# EAGLE design zeta2rework_lw_v2 (EAGLE 9.0.1)
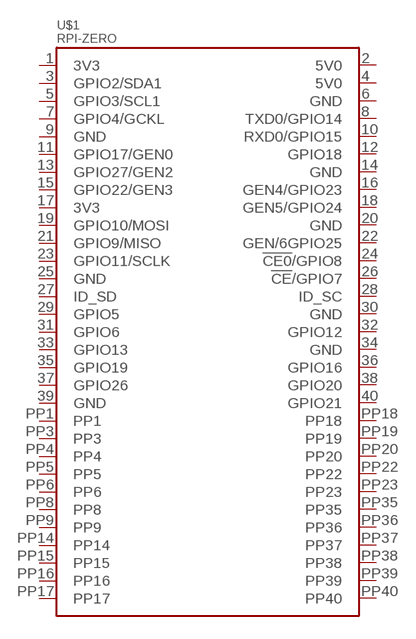
[diagram p0: schematic, sheet 1, part 1 of 2]
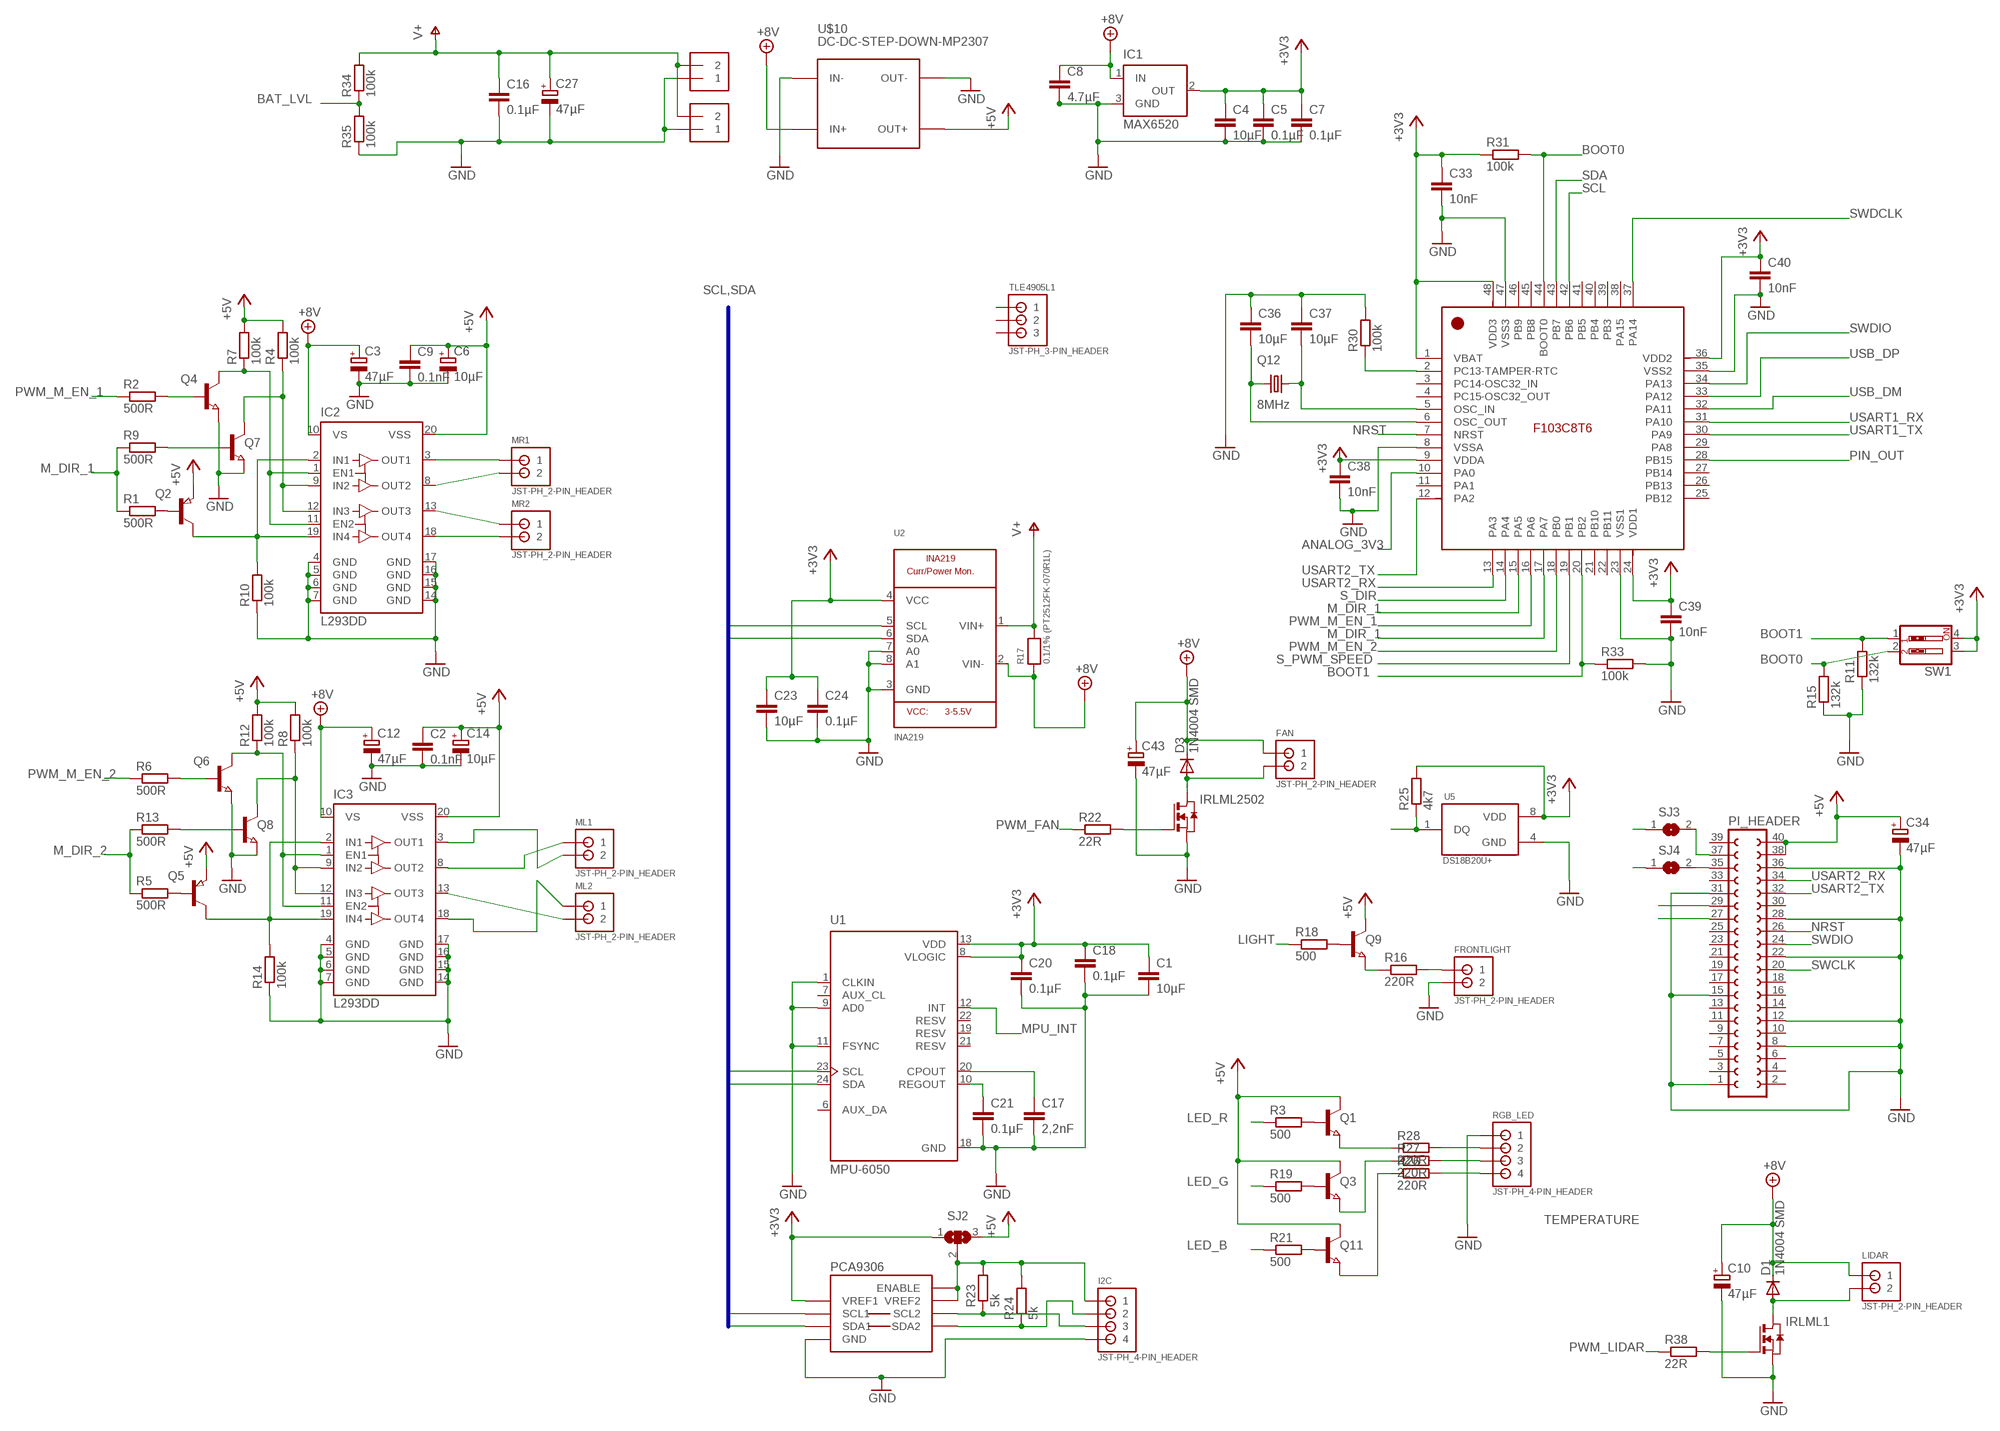
[diagram p1: schematic, sheet 1, part 2 of 2]

## Parts
C1  10µF  C-EUC1206  [C1206]
C2  0.1nF  C-EUC1206  [C1206]
C3  47µF  CPOL-EUUD-4X5,8  [UD-4X5,8_NICHICON]
C4  10µF  C-EUC1206  [C1206]
C5  0.1µF  C-EUC1206  [C1206]
C6  10µF  CPOL-EUUD-4X5,8  [UD-4X5,8_NICHICON]
C7  0.1µF  C-EUC1206  [C1206]
C8  4.7µF  C-EUC1206  [C1206]
C9  0.1nF  C-EUC1206  [C1206]
C10  47µF  CPOL-EUUD-4X5,8  [UD-4X5,8_NICHICON]
C12  47µF  CPOL-EUUD-4X5,8  [UD-4X5,8_NICHICON]
C14  10µF  CPOL-EUUD-4X5,8  [UD-4X5,8_NICHICON]
C16  0.1µF  C-EUC1206  [C1206]
C17  2,2nF  C-EUC1206  [C1206]
C18  0.1µF  C-EUC1206  [C1206]
C20  0.1µF  C-EUC1206  [C1206]
C21  0.1µF  C-EUC1206  [C1206]
C23  10µF  C-EUC1206  [C1206]
C24  0.1µF  C-EUC1206  [C1206]
C27  47µF  CPOL-EUUD-4X5,8  [UD-4X5,8_NICHICON]
C33  10nF  C-EUC1206  [C1206]
C34  47µF  CPOL-EUUD-4X5,8  [UD-4X5,8_NICHICON]
C36  10µF  C-EUC1206  [C1206]
C37  10µF  C-EUC1206  [C1206]
C38  10nF  C-EUC1206  [C1206]
C39  10nF  C-EUC1206  [C1206]
C40  10nF  C-EUC1206  [C1206]
C43  47µF  CPOL-EUUD-4X5,8  [UD-4X5,8_NICHICON]
D1  1N4004 SMD  DIODE-MELF-MLL41  [MELF-MLL41]
D3  1N4004 SMD  DIODE-MELF-MLL41  [MELF-MLL41]
FAN  JST-PH_2-PIN_HEADER  [JST_B2B-PH_HEADER]
FRONTLIGHT  JST-PH_2-PIN_HEADER  [JST_B2B-PH_HEADER]
I2C  JST-PH_4-PIN_HEADER  [JST_B4B-PH_HEADER]
IC1  MAX6520  [SOT23]
IC2  L293DD  [SO20]
IC3  L293DD  [SO20]
IRLML1  NMOSSOT23  [SOT-23]
IRLML2502  NMOSSOT23  [SOT-23]
LIDAR  JST-PH_2-PIN_HEADER  [JST_B2B-PH_HEADER]
ML1  JST-PH_2-PIN_HEADER  [JST_B2B-PH_HEADER]
ML2  JST-PH_2-PIN_HEADER  [JST_B2B-PH_HEADER]
MR1  JST-PH_2-PIN_HEADER  [JST_B2B-PH_HEADER]
MR2  JST-PH_2-PIN_HEADER  [JST_B2B-PH_HEADER]
PCA9306  IC2_LEVEL_TRANSLATER  [SOIC-8]
PI_HEADER  FE20-2  [FE20-2]
Q1  NPN-TRANSISTOR_SOT23  [SOT23]
Q2  PNP-TRANSISTOR_SOT23  [SOT23]
Q3  NPN-TRANSISTOR_SOT23  [SOT23]
Q4  NPN-TRANSISTOR_SOT23  [SOT23]
Q5  PNP-TRANSISTOR_SOT23  [SOT23]
Q6  NPN-TRANSISTOR_SOT23  [SOT23]
Q7  NPN-TRANSISTOR_SOT23  [SOT23]
Q8  NPN-TRANSISTOR_SOT23  [SOT23]
Q9  NPN-TRANSISTOR_SOT23  [SOT23]
Q11  NPN-TRANSISTOR_SOT23  [SOT23]
Q12  8MHz  KX-13  [7.0X5.0]
R1  500R  R-EU_R0603  [R0603]
R2  500R  R-EU_R0603  [R0603]
R3  500  R-EU_R1206  [R1206]
R4  100k  R-EU_R0603  [R0603]
R5  500R  R-EU_R0603  [R0603]
R6  500R  R-EU_R0603  [R0603]
R7  100k  R-EU_R0603  [R0603]
R8  100k  R-EU_R0603  [R0603]
R9  500R  R-EU_R0603  [R0603]
R10  100k  R-EU_R0603  [R0603]
R11  132k  R-EU_R0603  [R0603]
R12  100k  R-EU_R0603  [R0603]
R13  500R  R-EU_R0603  [R0603]
R14  100k  R-EU_R0603  [R0603]
R15  132k  R-EU_R0603  [R0603]
R16  220R  R-EU_R0603  [R0603]
R17  0.1/1% (PT2512FK-070R1L)  RESISTOR2512  [2512]
R18  500  R-EU_R1206  [R1206]
R19  500  R-EU_R1206  [R1206]
R21  500  R-EU_R0603  [R0603]
R22  22R  R-EU_R0603  [R0603]
R23  5k  R-EU_R0603  [R0603]
R24  5k  R-EU_R0603  [R0603]
R25  4k7  R-EU_R0603  [R0603]
R26  220R  R-EU_R0603  [R0603]
R27  220R  R-EU_R0603  [R0603]
R28  220R  R-EU_R0603  [R0603]
R30  100k  R-EU_R0603  [R0603]
R31  100k  R-EU_R0603  [R0603]
R33  100k  R-EU_R0603  [R0603]
R34  100k  R-EU_R0603  [R0603]
R35  100k  R-EU_R0603  [R0603]
R38  22R  R-EU_R0603  [R0603]
RGB_LED  JST-PH_4-PIN_HEADER  [JST_B4B-PH_HEADER]
SJ2  SJ2W  [SJ_2]
SJ3  SOLDERJUMPERREFLOW_NOPASTE  [SOLDERJUMPER_REFLOW_NOPASTE]
SJ4  SOLDERJUMPERREFLOW_NOPASTE  [SOLDERJUMPER_REFLOW_NOPASTE]
SUPPLY_IN  TERMBLOCK_1X2-3.5MM  [1X2-3.5MM]
SUPPLY_IN1  TERMBLOCK_1X2-3.5MM  [1X2-3.5MM]
SW1  SW_DIP-2  [EDG-02]
TLE4905L1  JST-PH_3-PIN_HEADER  [JST_B3B-PH_HEADER]
U1  MPU-6050  [QFN50P400X400X95-24N]
U2  INA219  [SOT23-8]
U5  DS18B20U+  [SOP65P490X95-8N]
U$1  RPI-ZERO  [RASP_PI_ZERO_BOARD_FULL]
U$4  STM32F103C8T6  [LQFP48_7X7MM_0.5MMPP]
U$10  DC-DC-STEP-DOWN-MP2307  [DC-DC-STEP-DOWN-MP2307]

## Nets
+3V3: C1.1 C4.1 C5.1 C7.1 C18.1 C20.1 C23.1 C24.1 C33.1 C38.1 C39.1 C40.1 IC1.2(OUT) PCA9306.1(VREF1) R25.2 R31.1 SJ2.1 SW1.3 SW1.4 U1.8(VLOGIC) U1.13(VDD) U2.4(VCC) U5.8(VDD) U$4.1(VBAT) U$4.9(VDDA) U$4.24(VDD1) U$4.36(VDD2) U$4.48(VDD3)
+5V: C2.1 C6.+ C9.1 C14.+ C34.+ IC2.20(VSS) IC3.20(VSS) PI_HEADER.38 PI_HEADER.40 Q1.3(C) Q2.2(E) Q3.3(C) Q5.2(E) Q9.3(C) Q11.3(C) R4.2 R7.2 R8.2 R12.2 SJ2.3 U$10.OUT+
+8V: C3.+ C8.1 C10.+ C12.+ C43.+ D1.C D3.C FAN.P1 IC1.1(IN) IC2.10(VS) IC3.10(VS) LIDAR.P1 R17.1 U2.2(VIN-) U$10.IN+
ANALOG_3V3: U$4.10(PA0)
BAT_LVL: R34.1 R35.2
BOOT0: R15.2 R31.2 SW1.2 U$4.44(BOOT0)
BOOT1: R11.2 R33.1 SW1.1 U$4.20(PB2)
BOOT2: PI_HEADER.29
BOOT3: PI_HEADER.27
GND: C1.2 C2.2 C3.- C4.2 C5.2 C6.- C7.2 C8.2 C9.2 C10.- C12.- C14.- C16.2 C17.2 C18.2 C20.2 C21.2 C23.2 C24.2 C27.- C33.2 C34.- C36.1 C37.1 C38.2 C39.2 C40.2 C43.- FRONTLIGHT.P2 I2C.P4 IC1.3(GND) IC2.4(GND) IC2.5(GND) IC2.6(GND) IC2.7(GND) IC2.14(GND) IC2.15(GND) IC2.16(GND) IC2.17(GND) IC3.4(GND) IC3.5(GND) IC3.6(GND) IC3.7(GND) IC3.14(GND) IC3.15(GND) IC3.16(GND) IC3.17(GND) IRLML1.2(S) IRLML2502.2(S) PCA9306.4(GND) PI_HEADER.1 PI_HEADER.8 PI_HEADER.12 PI_HEADER.15 PI_HEADER.22 PI_HEADER.28 PI_HEADER.31 PI_HEADER.36 Q4.2(E) Q6.2(E) Q7.2(E) Q8.2(E) R10.1 R11.1 R14.1 R15.1 R30.2 R33.2 R35.1 RGB_LED.P1 SUPPLY_IN1.1 SUPPLY_IN.1 U1.1(CLKIN) U1.9(AD0) U1.11(FSYNC) U1.18(GND) U2.3(GND) U2.7(A0) U2.8(A1) U5.4(GND) U$4.8(VSSA) U$4.23(VSS1) U$4.35(VSS2) U$4.47(VSS3) U$10.IN- U$10.OUT-
LED_B: R21.1
LED_G: R19.1
LED_R: R3.1
LIGHT: R18.1
M_DIR_1: R1.1 R9.1 U$4.15(PA5) U$4.17(PA7)
M_DIR_2: R5.1 R13.1
MPU_INT: U1.12(INT)
N$1: IC2.9(IN2) IC2.12(IN3) Q7.3(C) R4.1
N$2: IC3.18(OUT4) ML2.P1
N$3: IC3.13(OUT3) ML2.P2
N$4: IC2.18(OUT4) MR2.P2
N$5: IC2.2(IN1) IC2.19(IN4) Q2.3(C) R10.2
N$6: IC3.9(IN2) IC3.12(IN3) Q8.3(C) R8.1
N$7: IC3.2(IN1) IC3.19(IN4) Q5.3(C) R14.2
N$8: IC2.1(EN1) IC2.11(EN2) Q4.3(C) R7.1
N$9: IC3.1(EN1) IC3.11(EN2) Q6.3(C) R12.1
N$10: Q2.1(B) R1.2
N$11: Q4.1(B) R2.2
N$12: Q7.1(B) R9.2
N$13: Q5.1(B) R5.2
N$14: Q6.1(B) R6.2
N$15: Q8.1(B) R13.2
N$16: IC2.13(OUT3) MR2.P1
N$17: IC2.8(OUT2) MR1.P2
N$18: IC2.3(OUT1) MR1.P1
N$19: Q9.1(B) R18.2
N$20: Q9.2(E) R16.1
N$21: FRONTLIGHT.P1 R16.2
N$22: Q1.1(B) R3.2
N$23: Q3.1(B) R19.2
N$24: Q1.2(E) R28.1
N$25: IC3.8(OUT2) ML1.P1
N$26: IC3.3(OUT1) ML1.P2
N$28: Q3.2(E) R27.1
N$30: Q11.2(E) R26.1
N$31: R26.2 RGB_LED.P4
N$32: Q11.1(B) R21.2
N$33: R27.2 RGB_LED.P3
N$34: C17.1 U1.20(CPOUT)
N$35: R28.2 RGB_LED.P2
N$36: C21.1 U1.10(REGOUT)
N$37: IRLML2502.3(G) R22.2
N$38: IRLML1.3(G) R38.2
N$39: D1.A IRLML1.1(D) LIDAR.P2
N$41: I2C.P1 PCA9306.7(VREF2) PCA9306.8(ENABLE) R23.2 R24.2 SJ2.2
N$42: I2C.P3 PCA9306.6(SCL2) R23.1
N$43: I2C.P2 PCA9306.5(SDA2) R24.1
N$44: PI_HEADER.37 SJ3.2
N$45: PI_HEADER.35 SJ4.2
N$46: C36.2 Q12.1 U$4.6(OSC_OUT)
N$47: C37.2 Q12.3 U$4.5(OSC_IN)
N$49: R30.1 U$4.2(PC13-TAMPER-RTC)
N$55: D3.A FAN.P2 IRLML2502.1(D)
NRST: PI_HEADER.26 U$4.7(NRST)
PIN_OUT: U$4.28(PB15)
PWM_FAN: R22.1
PWM_LIDAR: R38.1
PWM_M_EN_1: R2.1 U$4.16(PA6)
PWM_M_EN_2: R6.1 U$4.18(PB0)
S_DIR: U$4.14(PA4)
S_PWM_SPEED: U$4.19(PB1)
SCL: U1.23(SCL) U2.5(SCL) U$4.42(PB6)
SCL2: PCA9306.2(SCL1)
SCL3: SJ4.1
SDA: U1.24(SDA) U2.6(SDA) U$4.43(PB7)
SDA2: PCA9306.3(SDA1)
SDA3: SJ3.1
SWCLK: PI_HEADER.20
SWDCLK: U$4.37(PA14)
SWDIO: PI_HEADER.24 U$4.34(PA13)
TEMPERATURE: R25.1 U5.1(DQ)
USART1_RX: U$4.31(PA10)
USART1_TX: U$4.30(PA9)
USART2_RX: PI_HEADER.34 U$4.13(PA3)
USART2_TX: PI_HEADER.32 U$4.12(PA2)
USB_DM: U$4.32(PA11)
USB_DP: U$4.33(PA12)
V+: C16.1 C27.+ R17.2 R34.2 SUPPLY_IN1.2 SUPPLY_IN.2 U2.1(VIN+)
Unconnected: PI_HEADER.2 PI_HEADER.3 PI_HEADER.4 PI_HEADER.5 PI_HEADER.6 PI_HEADER.7 PI_HEADER.9 PI_HEADER.10 PI_HEADER.11 PI_HEADER.13 PI_HEADER.14 PI_HEADER.16 PI_HEADER.17 PI_HEADER.18 PI_HEADER.19 PI_HEADER.21 PI_HEADER.23 PI_HEADER.25 PI_HEADER.30 PI_HEADER.33 PI_HEADER.39 TLE4905L1.P1 TLE4905L1.P2 TLE4905L1.P3 U1.6(AUX_DA) U1.7(AUX_CL) U1.19(RESV) U1.21(RESV) U1.22(RESV) U$1.1(3V3) U$1.2(5V0) U$1.3(GPIO2/SDA1) U$1.4(5V0) U$1.5(GPIO3/SCL1) U$1.6(GND) U$1.7(GPIO4/GCKL) U$1.8(TXD0/GPIO14) U$1.9(GND) U$1.10(RXD0/GPIO15) U$1.11(GPIO17/GEN0) U$1.12(GPIO18) U$1.13(GPIO27/GEN2) U$1.14(GND) U$1.15(GPIO22/GEN3) U$1.16(GEN4/GPIO23) U$1.17(3V3) U$1.18(GEN5/GPIO24) U$1.19(GPIO10/MOSI) U$1.20(GND) U$1.21(GPIO9/MISO) U$1.22(GEN/6GPIO25) U$1.23(GPIO11/SCLK) U$1.24(!CE0!/GPIO8) U$1.25(GND) U$1.26(!CE!/GPIO7) U$1.27(ID_SD) U$1.28(ID_SC) U$1.29(GPIO5) U$1.30(GND) U$1.31(GPIO6) U$1.32(GPIO12) U$1.33(GPIO13) U$1.34(GND) U$1.35(GPIO19) U$1.36(GPIO16) U$1.37(GPIO26) U$1.38(GPIO20) U$1.39(GND) U$1.40(GPIO21) U$1.PP1 U$1.PP3 U$1.PP4 U$1.PP5 U$1.PP6 U$1.PP8 U$1.PP9 U$1.PP14 U$1.PP15 U$1.PP16 U$1.PP17 U$1.PP18 U$1.PP19 U$1.PP20 U$1.PP22 U$1.PP23 U$1.PP35 U$1.PP36 U$1.PP37 U$1.PP38 U$1.PP39 U$1.PP40 U$4.3(PC14-OSC32_IN) U$4.4(PC15-OSC32_OUT) U$4.11(PA1) U$4.21(PB10) U$4.22(PB11) U$4.25(PB12) U$4.26(PB13) U$4.27(PB14) U$4.29(PA8) U$4.38(PA15) U$4.39(PB3) U$4.40(PB4) U$4.41(PB5) U$4.45(PB8) U$4.46(PB9)

## Buses
SCL,SDA

## Library data of the parts
C1 C2 C4 C5 C7-C9 C16-C18 C20 C21 C23 C24 C33 C36-C40 = rcl:C-EU: CAPACITOR, European symbol; SPICEPREFIX: C
C3 C6 C10 C12 C14 C27 C34 C43 = rcl:CPOL-EU: POLARIZED CAPACITOR, European symbol; SPICEPREFIX: C
D1 D3 = diode:DIODE-: DIODE
FAN FRONTLIGHT LIDAR ML1 ML2 MR1 MR2 = srg:JST-PH_2-PIN_HEADER: 2-pin JST PH Shrouded Header, top entry P/N B2B-PH-K-S Mating connector PHR-2 Mating cable assembly: Sparkfun PRT-09914 <http://www.sparkfun.com/products/9914>
I2C RGB_LED = srg:JST-PH_4-PIN_HEADER: 4-pin JST PH Shrouded Header, top entry P/N B4B-PH-K-S Mating connector PHR-4 Mating cable assembly: Sparkfun PRT-09916 <http://www.sparkfun.com/products/9916>
IC1 = maxim:MAX6520: 1.2V Voltage Reference 50ppm/°C, SOT23, 3-Terminal Source: Data sheet <http://datasheets.maxim-ic.com/en/ds/MAX6520.pdf>; MF: MAXIM; MPN: MAX6520EUR-T; OC_FARNELL: unknown; OC_NEWARK: 02J4586
IC2 IC3 = st-microelectronics:L293DD: PUSH-PULL FOUR CHANNEL DRIVER WITH DIODES Source: http://www.st.com/stonline/books/pdf/docs/1330.pdf; OC_FARNELL: unknown
IRLML1 IRLML2502 = zetex:NMOSSOT23: MOS FET; OC_FARNELL: unknown; OC_NEWARK: unknown
PCA9306 = srg:IC2_LEVEL_TRANSLATER: I2C Level Translator PCA9306 Data Sheet <http://www.ti.com/lit/ds/symlink/pca9306.pdf> Sparkfun breakout board schematic <http://dlnmh9ip6v2uc.cloudfront.net/datasheets/BreakoutBoards/PCA9306_Breakout.pdf>
PI_HEADER = con-lsta:FE20-2: FEMALE HEADER; OC_FARNELL: unknown; OC_NEWARK: unknown
Q1 Q3 Q4 Q6-Q9 Q11 = semicon-smd-ipc:NPN-TRANSISTOR_: NPN TRANSISTOR
Q2 Q5 = semicon-smd-ipc:PNP-TRANSISTOR_: PNP TRANSISTOR
Q12 = crystal-geyer_V1_0:KX: Quartz Crystals (MHz) SMD: KX - Serie Model Size l/w/h [mm] Frequency Range Frequency Stability Temp. Range [°C] Load Capacitance AECQ 200 availabel Datasheet KX-4 KX-5 KX-6 KX-7 KX-9A KX-9B KX-12A KX-12B KX-13 KX-20 KX-K KX-KS 1.6/1.2/0.3 2.0/1.6/0.45 2.5/2.0/0.55 3.2/2.5/0.8 5.0/3.2/1.0 5.0/3.2/1.1 6.0/3.5/1.1 6.0/3.5/1.0 7.0/5.0 /1.3 11.6/5.5/1.6 12.3/4.5/4.2 12.3/4.5/3.2 24.0 ~ 80.0 MHz 16.0 ~ 80.0 MHz 12.0 ~ 80.0 MHz 8.0 ~ 60.0 MHz 7,68 ~ 300,0 MHz 8,0 ~ 50,0 MHz 8,0 ~ 150,0 MHz 8,0 ~ 50,0 MHz 6,0 ~ 160,0 MHz 3,579 ~ 25,0 MHz 3,579 ~ 70,0 MHz 3,579 ~ 70,0 MHz ±10 … ±50ppm ±10 … ±50ppm ±10 … ±50ppm ±10 … ±50ppm ±10 … ±50ppm ±10 … ±50ppm ±10 … ±50ppm ±10 … ±50ppm ±10 … ±50ppm ±50ppm ±10 … ±50ppm ±10 … ±50ppm (*) -40°C …+85°C (*) -40°C …+125°C (*) -40°C …+125°C (*) -40°C …+125°C (*) -40°C …+105°C (*) -40°C …+105°C (*) -40°C …+125°C (*) -40°C …+105°C (*) -40°C …+105°C (*) -40°C …+105°C (*) -40°C …+85°C (*) -40°C …+85°C 8, 8…16 8, 8…16 10, 8…16 12, 7…20 16, 10…20 16, 10…20 16, 10…20 16, 12…20 16, 12…20 16, 12…20 16, 12…30 16, 12…30 - yes yes yes - - - - - - - - KX-4.pdf <http://www.geyer-electronic.de/uploads/tx_userartikelfrequenz/GEYER-KX-4.pdf> KX-5.pdf <http://www.geyer-electronic.de/uploads/tx_userartikelfrequenz/GEYER-KX-5.pdf> KX-6.pdf <http://www.geyer-electronic.de/uploads/tx_userartikelfrequenz/GEYER-KX-6.pdf> KX-7.pdf <http://www.geyer-electronic.de/uploads/tx_userartikelfrequenz/GEYER-KX-7.pdf> KX-9A.pdf <http://www.geyer-electronic.de/uploads/tx_userartikelfrequenz/GEYER-KX-9A.pdf> KX-9B.pdf <http://www.geyer-electronic.de/uploads/tx_userartikelfrequenz/GEYER-KX-9B.pdf> KX-12A.pdf <http://www.geyer-electronic.de/uploads/tx_userartikelfrequenz/GEYER-KX-12A.pdf> KX-12B.pdf <http://www.geyer-electronic.de/uploads/tx_userartikelfrequenz/GEYER-KX-12B.pdf> KX-13.pdf <http://www.geyer-electronic.de/uploads/tx_userartikelfrequenz/GEYER-KX-13.pdf> KX-20.pdf <http://www.geyer-electronic.de/uploads/tx_userartikelfrequenz/GEYER-KX-20.pdf> KX-K.pdf <http://www.geyer-electronic.de/uploads/tx_userartikelfrequenz/GEYER-KX-K.pdf> KX-KS.pdf <http://www.geyer-electronic.de/uploads/tx_userartikelfrequenz/GEYER-KX-KS.pdf> <http://www.geyer-electronic.de/fileadmin/template/img/logo-geyer-electronic.png> Details see: http://www.geyer-electronic.de/Frequenz-Produkte.9.0.html Created 2016-06-07, Hans Locher 2016 (C) Geyer Quartz Technology KX4,KX5,KX6,KX7,KX9A,KX9B,KX12A,KX12B,KX13,KX20,KXK,KXKS;1612;2016;2520;3225;5032;6035;7050;11655;12345;1,6x1,2;2,0x1,6;2,5x2,0;3,2x2,5;5,0x3,2;6,0x3,5;7,0x5,0;11,6x5,5;12,3x4,5;12,3x4,5;1.6x1.2;2.0x1.6;2.5x2.0;3.2x2.5;5.0x3.2;6.0x3.5;7.0x5.0;11.6x5.5;12.3x4.5;12.3x4.5;
R1-R16 R18 R19 R21-R28 R30 R31 R33-R35 R38 = rcl:R-EU_: RESISTOR, European symbol; SPICEPREFIX: R
R17 = microbuilder:RESISTOR: Resistors 0402 - 0402 Surface Mount Package 22 Ohm 1% 1/16W [Digikey: 311-22.0LRTR-ND] 33 Ohm 5% 1/16W 1.0K 5% 1/16W 1.5K 5% 1/16W 2.0K 1% 1/16W 10.0K 1% 1/16W [Digikey: 311-10.0KLRTR-ND] 10.0K 5% 1/16W [Digikey: RMCF0402JT10K0TR-ND] 12.1K 1% 1/16W [Digikey: 311-22.0LRTR-ND] 100.0K 5% 1/16W 0603 - 0603 Surface Mount Package 0 Ohm 1/10 Watt 1% Resistor 15 Ohm 1/10 Watt 1% Resistor 33 Ohm 1/10 Watt 1% Resistor 49.9 Ohm 1/10 Watt 1% Resistor 100 Ohm 1/10 Watt 1% Resistor 150 Ohm 1/10 Watt 1% Resistor 240 Ohm 1/10 Watt 1% Resistor 390 Ohm 1/10 Watt 1% Resistor 560 Ohm 1/10 Watt 1% Resistor 680 Ohm 1/10 Watt 1% Resistor 750 Ohm 1/10 Watt 1% Resistor 1.0K Ohm 1/10 Watt 1% Resistor 1.5K Ohm 1/10 Watt 1% Resistor 2.0K Ohm 1/10 Watt 1% Resistor 2.2K Ohm 1/10 Watt 1% Resistor 3.3K Ohm 1/10 Watt 1% Resistor 4.7K Ohm 1/10 Watt 1% Resistor 10.0K Ohm 1/10 Watt 1% Resistor 12.0K Ohm 1/10 Watt 1% Resistor 12.1K Ohm 1/10 Watt 1% Resistor 20.0K Ohm 1/10 Watt 1% Resistor 33.0K Ohm 1/10 Watt 1% Resistor 100.0K Ohm 1/10 Watt 1% Resistor 0805 - 0805 Surface Mount Package 0 Ohm 1/8 Watt 1% Resistor 33 Ohm 1/8 Watt 1% Resistor 100 Ohm 1/8 Watt 1% Resistor 150 Ohm 1/8 Watt 1% Resistor 200 Ohm 1/8 Watt 1% Resistor 240 Ohm 1/8 Watt 1% Resistor 330 Ohm 1/8 Watt 1% Resistor 390 Ohm 1/8 Watt 1% Resistor 470 Ohm 1/8 Watt 1% Resistor 1.0K Ohm 1/8 Watt 1% Resistor 1.5K Ohm 1/8 Watt 1% Resistor 2.0K Ohm 1/8 Watt 1% Resistor 4.7K Ohm 1/8 Watt 1% Resistor 5.1K Ohm 1/8 Watt 1% Resistor 5.6K Ohm 1/8 Watt 1% Resistor 10.0K Ohm 1/8 Watt 1% Resistor 22.0K Ohm 1/8 Watt 1% Resistor 33.0K Ohm 1/8 Watt 1% Resistor 100K Ohm 1/8 Watt 1% Resistor 1206 - 1206 Surface Mount Package 2012 - 2010 Surface Mount Package 0.11 Ohm 1/2 Watt 1% Resistor - Digikey: RHM.11UCT-ND
SJ2 = jumper:SJ2W: SMD solder JUMPER
SJ3 SJ4 = microbuilder:SOLDERJUMPER: SMD Solder JUMPER Solder the two pads together to create a connection, or remove the solder to break it. REFLOW - Use this footprint for solder paste and reflow ovens. WAVE - Use this footprint for hand-soldering (larger pads). CLOSED - Has a trace between the two pads to ensure it is closed by default. The trace needs to be cut to disable the jumper, and can be closed again by creating a solder bridge between the two pads.
SUPPLY_IN SUPPLY_IN1 = microbuilder:TERMBLOCK_1X2: 3.5mm Terminal block http://www.ladyada.net/library/pcb/eaglelibrary.html
SW1 = special:SW_DIP-2: DIP SWITCH
TLE4905L1 = srg:JST-PH_3-PIN_HEADER: 3-pin JST PH Shrouded Header, top entry P/N B3B-PH-K-S Mating connector PHR-3
U1 = MPU-6050:MPU-6050: MPU-6050 Six-Axis (Gyro + Accelerometer) MEMS MotionTracking™ Devices; AVAILABILITY: Good; DESCRIPTION: 3-axis gyroscope, 3-axis accelerometer in a 4x4x0.9 housing; MF: TDK; MP: MPU-6050; PACKAGE: QFN-24 InvenSense; PRICE: 5.12 USD
U2 = INA219:INA219: INA219 - I2C Current/Power Monitor Voltage Range: 0-26V Accuracy: 0.5% Temperature: -40°C - 125°C; AVAILABILITY: Unavailable; DESCRIPTION: the ina219 is a high-side current shunt and power monitor with an i2c interface. the ina219 monitors both shunt drop ...; MF: Texas Instruments; MP: INA219; PACKAGE: None; PRICE: None
U5 = DS18B20U_:DS18B20U+: Board Mount Temperature Sensors Prgmble Resolution 1-Wire Parasite Pwr; AVAILABILITY: Unavailable; DESCRIPTION: Date Code: 1043+; RoHS Compliant: Yes;; MF: Maxim; MP: DS18B20U+; PACKAGE: TSSOP-8 Chip Coolers; PRICE: None
U$1 = rpi-zero:RPI-ZERO
U$4 = STM32F103C8T6:STM32F103C8T6; AVAILABILITY: Good; DESCRIPTION: Mainstream Performance line, ARM Cortex-M3 MCU with 64 Kbytes Flash, 72 MHz CPU, motor control, USB and CAN; MF: STMicroelectronics; MP: STM32F103C8T6; PACKAGE: LQFP-48 STMicroelectronics; PRICE: 3.83 USD
U$10 = diy-modules:DC-DC-STEP-DOWN-MP2307: DC/DC Step-Down Regulator based on MP2307DN chip MP2307 datasheet available here: https://cdn-shop.adafruit.com/datasheets/MP2307_r1.9.pdf Click here to find device on ebay.com <http://www.ebay.com/sch/dc+dc+3a+mini+converter>

## Board
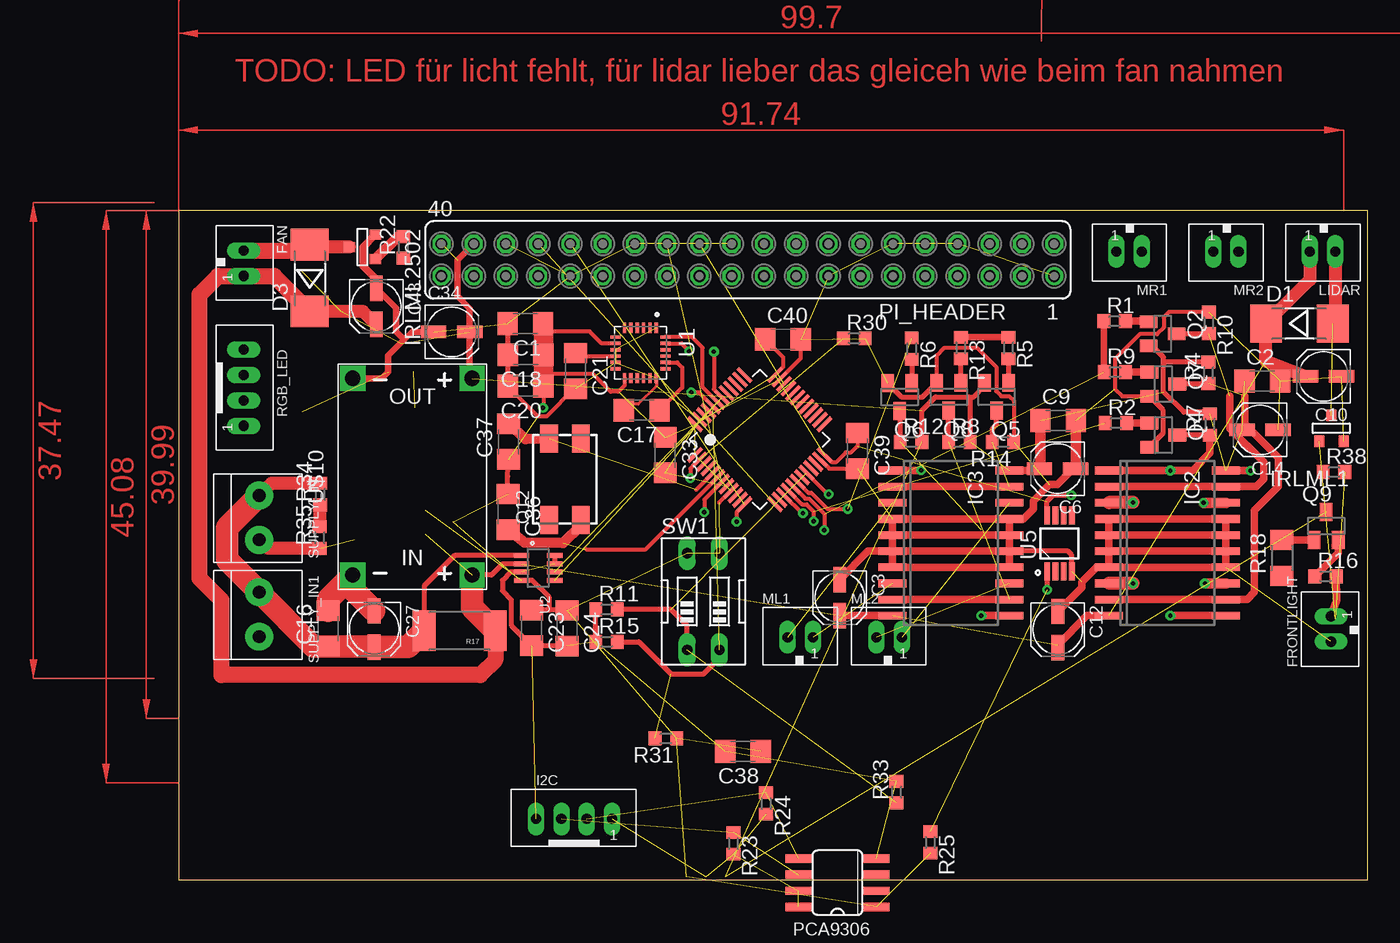
[diagram p2: board, top side]
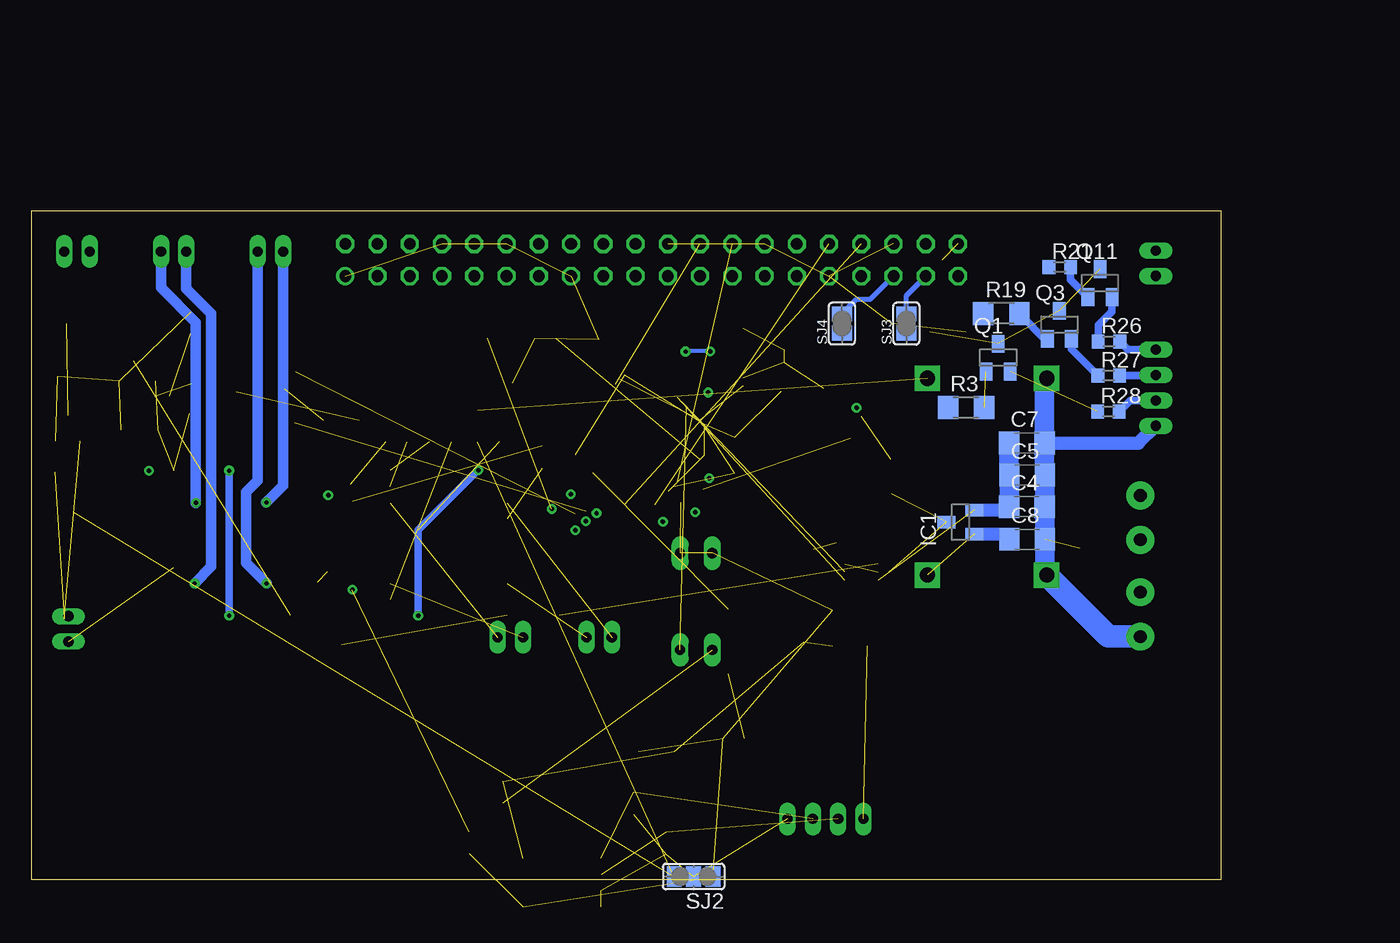
[diagram p3: board, bottom side, seen from below]

Size 93.65 x 52.7 mm. Coordinates in mm from the lower left corner, seen from the top.
Outline: 0,0 93.65,0 93.65,52.7 0,52.7 0,0
Copper layers (1*16): Top 0.035mm / dielectric 1.5mm / Bottom 0.035mm
Design rules "default": minimum track width 6mil, minimum drill 0.35mm, track to track 6mil, track to pad 6mil, pad to pad 6mil, via to via 6mil, smd to smd 6mil, copper to edge 40mil, drill to drill 6mil, minimum pad ring 10mil, minimum via ring 8mil, stop-mask expansion 4mil, vias tented up to drill 0mil, thermal gap 10mil

### Footprints (pad centres in the part's own frame; a part is rotated, then mirrored left to right if it is on the bottom)
C1206 = smd 1.6 x 1.8: 1 -1.4,0; 2 1.4,0
UD-4X5,8_NICHICON = smd 2 x 1: + 1.425,0; - -1.425,0
MELF-MLL41 = smd 2.5 x 3: A 2.625,0; C -2.625,0
JST_B2B-PH_HEADER = drill 0.8 long: P1 1.075,0.048; P2 -0.925,0.048
JST_B4B-PH_HEADER = drill 0.8 long: P1 2.98,0.048; P2 0.98,0.048; P3 -1.02,0.048; P4 -3.02,0.048
SOT23 = smd 1 x 1.4: 1 -0.95,-1.1; 2 0.95,-1.1; 3 0,1.1
SO20 = smd 0.6 x 2.2: 1 -5.715,-4.6; 2 -4.445,-4.6; 3 -3.175,-4.6; 4 -1.905,-4.6; 5 -0.635,-4.6; 6 0.635,-4.6; 7 1.905,-4.6; 8 3.175,-4.6; 9 4.445,-4.6; 10 5.715,-4.6; 11 5.715,4.6; 12 4.445,4.6; 13 3.175,4.6; 14 1.905,4.6; 15 0.635,4.6; 16 -0.635,4.6; 17 -1.905,4.6; 18 -3.175,4.6; 19 -4.445,4.6; 20 -5.715,4.6
SOT-23 = smd 0.787 x 0.889: 1 0.025,-1.016; 2 -0.94,1.016; 3 0.991,1.016
SOIC-8 = smd 0.66 x 2.032: 1 -1.905,-3.073; 2 -0.635,-3.073; 3 0.635,-3.073; 4 1.905,-3.073; 5 1.905,3.073; 6 0.635,3.073; 7 -0.635,3.073; 8 -1.905,3.073
FE20-2 = drill 0.914: 1 -24.13,1.27 | drill 0.914 octagon: 2 -24.13,-1.27; 3 -21.59,1.27; 4 -21.59,-1.27; 5 -19.05,1.27; 6 -19.05,-1.27; 7 -16.51,1.27; 8 -16.51,-1.27; 9 -13.97,1.27; 10 -13.97,-1.27; 11 -11.43,1.27; 12 -11.43,-1.27; 13 -8.89,1.27; 14 -8.89,-1.27; 15 -6.35,1.27; 16 -6.35,-1.27; 17 -3.81,1.27; 18 -3.81,-1.27; 19 -1.27,1.27; 20 -1.27,-1.27; 21 1.27,1.27; 22 1.27,-1.27; 23 3.81,1.27; 24 3.81,-1.27; 25 6.35,1.27; 26 6.35,-1.27; 27 8.89,1.27; 28 8.89,-1.27; 29 11.43,1.27; 30 11.43,-1.27; 31 13.97,1.27; 32 13.97,-1.27; 33 16.51,1.27; 34 16.51,-1.27; 35 19.05,1.27; 36 19.05,-1.27; 37 21.59,1.27; 38 21.59,-1.27; 39 24.13,1.27; 40 24.13,-1.27
7.0X5.0 = smd 2.2 x 1.4: 1 -3.2,-1.25; 2 3.2,-1.25; 3 3.2,1.25; 4 -3.2,1.25
R0603 = smd 1 x 1.1: 1 -0.85,0; 2 0.85,0
R1206 = smd 1.6 x 1.803: 1 -1.422,0; 2 1.422,0
2512 = smd 1.8 x 3.2: 1 -2.8,0; 2 2.8,0
SJ_2 = smd 1.168 x 1.6: 1 -1.524,0; 2 0,0; 3 1.524,0
SOLDERJUMPER_REFLOW_NOPASTE = smd 1.168 x 1.6: 1 -0.762,0; 2 0.762,0
1X2-3.5MM = drill 1 pad 2.184: 1 1.8,0; 2 -1.7,0
EDG-02 = drill 0.813 long: 1 -1.27,-3.81; 2 1.27,-3.81; 3 1.27,3.81; 4 -1.27,3.81
JST_B3B-PH_HEADER = drill 0.8 long: P1 2.027,0.048; P2 0.028,0.048; P3 -1.972,0.048
QFN50P400X400X95-24N = smd 0.79 x 0.26: 1 -1.97,1.25; 2 -1.97,0.75; 3 -1.97,0.25; 4 -1.97,-0.25; 5 -1.97,-0.75; 6 -1.97,-1.25; 13 1.97,-1.25; 14 1.97,-0.75; 15 1.97,-0.25; 16 1.97,0.25; 17 1.97,0.75; 18 1.97,1.25 | smd 0.26 x 0.79: 7 -1.25,-1.97; 8 -0.75,-1.97; 9 -0.25,-1.97; 10 0.25,-1.97; 11 0.75,-1.97; 12 1.25,-1.97; 19 1.25,1.97; 20 0.75,1.97; 21 0.25,1.97; 22 -0.25,1.97; 23 -0.75,1.97; 24 -1.25,1.97
SOT23-8 = smd 0.4 x 1.2: 1 -0.975,-1.3; 2 -0.325,-1.3; 3 0.325,-1.3; 4 0.975,-1.3; 5 0.975,1.3; 6 0.325,1.3; 7 -0.325,1.3; 8 -0.975,1.3
SOP65P490X95-8N = smd 1.4 x 0.45: 1 -2.2,0.975; 2 -2.2,0.325; 3 -2.2,-0.325; 4 -2.2,-0.975; 5 2.2,-0.975; 6 2.2,-0.325; 7 2.2,0.325; 8 2.2,0.975
RASP_PI_ZERO_BOARD_FULL = drill 1 pad 1.778 square: 1 8.37,25.23 | drill 1 pad 1.778: 2 8.37,27.77; 3 10.91,25.23; 4 10.91,27.77; 5 13.45,25.23; 6 13.45,27.77; 7 15.99,25.23; 8 15.99,27.77; 9 18.53,25.23; 10 18.53,27.77; 11 21.07,25.23; 12 21.07,27.77; 13 23.61,25.23; 14 23.61,27.77; 15 26.15,25.23; 16 26.15,27.77; 17 28.69,25.23; 18 28.69,27.77; 19 31.23,25.23; 20 31.23,27.77; 21 33.77,25.23; 22 33.77,27.77; 23 36.31,25.23; 24 36.31,27.77; 25 38.85,25.23; 26 38.85,27.77; 27 41.39,25.23; 28 41.39,27.77; 29 43.93,25.23; 30 43.93,27.77; 31 46.47,25.23; 32 46.47,27.77; 33 49.01,25.23; 34 49.01,27.77; 35 51.55,25.23; 36 51.55,27.77; 37 54.09,25.23; 38 54.09,27.77; 39 56.63,25.23; 40 56.63,27.77 | drill 0.8 pad 1.778: PP1 10.699,4.832; PP3 7.593,8.858; PP4 7.133,14.38; PP5 55.796,23.124; PP6 10.699,2.301; PP8 5.177,8.858; PP9 9.549,14.38; PP14 58.327,18.407; PP15 55.796,14.265; PP16 55.796,20.363; PP17 58.212,21.743; PP18 55.796,17.027; PP19 58.327,15.186; PP20 56.832,9.434; PP35 17.257,2.416; PP36 60.628,12.425; PP37 56.026,2.071; PP38 53.726,2.416; PP39 58.097,12.54; PP40 18.867,6.212 | drill 0.8 pad 1.422: PP22 23.009,2.071; PP23 24.734,2.071 | hole 2.75: 3.5,3.5; 3.5,26.5; 61.5,3.5; 61.5,26.5
LQFP48_7X7MM_0.5MMPP = smd 1.5 x 0.3: 1 -4.45,2.75; 2 -4.45,2.25; 3 -4.45,1.75; 4 -4.45,1.25; 5 -4.45,0.75; 6 -4.45,0.25; 7 -4.45,-0.25; 8 -4.45,-0.75; 9 -4.45,-1.25; 10 -4.45,-1.75; 11 -4.45,-2.25; 12 -4.45,-2.75; 25 4.45,-2.75; 26 4.45,-2.25; 27 4.45,-1.75; 28 4.45,-1.25; 29 4.45,-0.75; 30 4.45,-0.25; 31 4.45,0.25; 32 4.45,0.75; 33 4.45,1.25; 34 4.45,1.75; 35 4.45,2.25; 36 4.45,2.75 | smd 0.3 x 1.5: 13 -2.75,-4.45; 14 -2.25,-4.45; 15 -1.75,-4.45; 16 -1.25,-4.45; 17 -0.75,-4.45; 18 -0.25,-4.45; 19 0.25,-4.45; 20 0.75,-4.45; 21 1.25,-4.45; 22 1.75,-4.45; 23 2.25,-4.45; 24 2.75,-4.45; 37 2.75,4.45; 38 2.25,4.45; 39 1.75,4.45; 40 1.25,4.45; 41 0.75,4.45; 42 0.25,4.45; 43 -0.25,4.45; 44 -0.75,4.45; 45 -1.25,4.45; 46 -1.75,4.45; 47 -2.25,4.45; 48 -2.75,4.45
DC-DC-STEP-DOWN-MP2307 = drill 1.2 pad 2 square: IN+ -7.747,-4.699; IN- -7.747,4.699; OUT+ 7.747,-4.699; OUT- 7.747,4.699

### Placement (x,y rotation side)
C1  27.3,43.82 180 top
C2  85.34,39.29 0 top
C3  52.07,22.23 270 top
C4  15.29,29.39 0 bottom
C5  15.27,31.88 0 bottom
C6  69.21,32.38 180 top
C7  15.29,34.39 0 bottom
C8  15.27,26.82 0 bottom
C9  69.27,36.17 0 top
C10  90.17,39.65 180 top
C12  69.24,19.71 270 top
C14  85.17,35.43 180 top
C16  11.79,19.79 90 top
C17  36.47,36.98 180 top
C18  27.33,41.35 180 top
C20  27.33,38.89 180 top
C21  31.27,40.08 270 top
C23  27.81,19.84 270 top
C24  30.61,19.81 270 top
C27  15.41,19.75 270 top
C33  38.33,33.45 270 top
C34  21.51,43.15 0 top
C36  25.96,28.98 270 top
C37  25.98,34.52 90 top
C38  44.45,10.11 180 top
C39  53.47,33.78 270 top
C40  47.6,42.57 359.8 top
C43  15.57,45.16 270 top
D1  88.27,43.82 0 top
D3  10.34,47.4 90 top
FAN  5.08,48.64 270 top
FRONTLIGHT  90.8,19.69 90 top
I2C  31.17,4.75 0 top
IC1  20.52,28.17 90 bottom
IC2  77.88,26.52 270 top
IC3  60.83,26.52 270 top
IRLML1  90.8,35.56 180 top
IRLML2502  14.48,49.86 270 top
LIDAR  90.17,49.53 180 top
ML1  48.9,19.05 0 top
ML2  55.88,19.05 0 top
MR1  74.93,49.53 180 top
MR2  82.55,49.53 180 top
PCA9306  51.89,-0.23 90 top
PI_HEADER  44.83,48.82 180 top
Q1  17.55,41.12 0 bottom
Q2  77.5,43 270 top
Q3  12.73,43.71 0 bottom
Q4  77.55,35.03 270 top
Q5  64.41,38.05 180 top
Q6  56.79,38.02 180 top
Q7  77.55,39.04 270 top
Q8  60.66,38.05 180 top
Q9  90.37,27.86 0 top
Q11  9.53,46.99 0 bottom
Q12  30.43,31.55 90 top
R1  73.71,43.99 0 top
R2  73.81,35.97 0 top
R3  20.07,37.19 0 bottom
R4  81.1,39.93 90 top
R5  65.35,41.88 270 top
R6  57.73,41.83 270 top
R7  81.23,35.86 90 top
R8  61.49,34.47 0 top
R9  73.74,39.98 0 top
R10  81.13,43.87 270 top
R11  33.71,21.29 0 top
R12  57.68,34.47 0 top
R13  61.6,41.88 270 top
R14  64.92,34.47 180 top
R15  33.71,18.75 0 top
R16  90.32,23.9 0 top
R17  22.15,19.61 180 top
R18  86.89,25.35 90 top
R19  17.3,44.6 0 bottom
R21  12.7,48.26 0 bottom
R22  17.7,49.81 90 top
R23  43.69,2.87 270 top
R24  46.28,6.02 270 top
R25  59.21,2.95 270 top
R26  8.81,42.39 0 bottom
R27  8.84,39.7 0 bottom
R28  8.86,36.88 0 bottom
R30  53.21,42.65 0 top
R31  38.38,11.13 180 top
R33  56.54,6.91 90 top
R34  11.15,30.38 90 top
R35  11.13,26.95 90 top
R38  90.98,32.11 0 top
RGB_LED  5.08,38.73 270 top
SJ2  41.53,0.25 180 bottom
SJ3  24.77,43.82 90 bottom
SJ4  29.84,43.82 90 bottom
SUPPLY_IN  6.35,28.58 270 top
SUPPLY_IN1  6.35,20.95 270 top
SW1  41.33,21.92 0 top
TLE4905L1  115.44,55.47 180 top  (outside the outline)
U1  36.37,41.5 270 top
U2  28.32,24.56 270 top
U5  69.37,26.49 90 top
U$1  -1.27,-50.16 0 top  (outside the outline)
U$4  45.77,34.67 45 top
U$10  18.41,31.75 90 top

### Tracks (layer width: path | path; a pad name or v marks a point on that pad's centre or on a via)
+3V3  (via drill 0.35)  (16 unrouted)
  Top 0.305: 28.76,43.82 28.73,43.79 | U1.8 33.31,42.25 32.38,43.18 28.73,43.18 | U1.13 35.12,38.93 34.65,38.46 34.04,38.46 32.64,39.85 28.73,39.85 | C20.1 28.73,37.21 v28.7,37.19 | 42.57,29.7 U$4.9 | U$4.36 47.62,40.41 47.62,41.15 C40.1 | C39.1 53.47,34.16 52.96,33.66 52.55,33.66 51.82,32.92 51.41,32.92 U$4.24
  Top 0.406: C24.1 30.58,21.24 29.21,21.24 | 29.21,21.24 C23.1 | 29.21,21.24 29.21,22.23 27.85,23.59 U2.4 | U5.8 68.39,29.78 68.91,30.3 v70.31,30.3
  Top 1.524: C20.1 28.73,39.85 C18.1 28.73,43.18 28.73,43.79 C1.1
  Bottom 1.016: IC1.2 16.96,29.12 C4.1
  Bottom 1.524: C4.1 16.66,29.41 C5.1 16.69,31.9 C7.1
+5V  (via drill 0.35)  (12 unrouted)
  Top 0.305: 76.44,42.05 Q2.2 | 63.46,38.87 Q5.2
  Top 0.406: Q2.2 76.67,42.05 77.57,41.15 77.57,40.64 | R12.2 58.53,36.94 59.61,38.02 62.23,38.02 | 63.46,38.87 62.62,38.02 62.23,38.02 | R8.2 62.34,37.91 62.23,38.02 | R7.2 81.11,36.83 79.15,36.83 77.57,38.41 77.57,40.64 | R4.2 77.71,40.78 77.57,40.64
  Top 0.508: PI_HEADER.38 21.97,48.82 21.97,45.97 22.94,45.01 C34.+ 22.94,39.67 U$10.OUT+
  Top 0.61: IC3.20 67.64,32.23 C6.+ | IC2.20 v84.43,32.23
  Top 0.813: C6.+ 67.87,32.46 C9.1
+8V  (4 unrouted)
  Top 0.406: 25.4,20.06 R17.1 | U2.2 25.52,24.89 24.64,24 U$10.IN+
  Top 0.61: IC3.10 C3.+ | C12.+ 69.24,18.52 71.53,20.8 IC2.10
  Top 1.016: C43.+ 14.54,44.77 D3.C | LIDAR.P1 89.09,47.27 D1.C 85.64,40.85 C10.+
  Top 1.27: R17.1 24.95,17.33 23.75,16.13 3.38,16.13 3.38,22.02 1.65,23.75 1.65,46.1 3.12,47.57 FAN.P1 7.54,47.57 D3.C
  Top 1.778: U$10.IN+ 23.11,21.44 R17.1
  Bottom 1.016: IC1.1 17.06,27.22 C8.1
BAT_LVL
  Top 1.016: R35.2 11.15,27.83 R34.1
BOOT0  (via drill 0.35)  (2 unrouted)
  Top 0.305: U$4.44 41,38.38 v40.39,38.38
  Top 0.406: R15.2 36.25,18.74 38.79,16.2 41.33,16.2 42.6,17.48 SW1.2
BOOT1  (via drill 0.35)  (2 unrouted)
  Top 0.305: U$4.20 51.15,30.35 v51.21,30.35
  Top 0.406: SW1.1 40.06,20.02 38.79,21.28 R11.2
GND  (38 unrouted)
  Top 0.254: U1.18 37.62,38.89 36.2,37.47 35.56,37.47 C17.2
  Top 0.305: C21.2 31.16,38.68 28.98,36.5 28.32,36.5 C20.2 | U$4.35 49,41.08 C40.2 | 76.44,38.1 Q7.2 74.3,38.09 73.74,38.66 73.74,41.02 75.69,42.98 77.06,42.98 77.59,43.51 77.59,44.32 77.99,44.72 R10.1 | Q8.2 59.71,41.29 60.33,41.91 62.87,41.91 64.39,40.39 64.39,38.49 64.78,38.1 65.41,38.1 65.77,37.73 R14.1 | U$4.23 51.24,32.38 C39.2
  Top 0.406: U2.8 U2.7 | C24.2 27.84,18.41 C23.2 26.2,20.05 26.2,22.06 25.5,22.76 25.5,23.6 26.14,24.24 U2.3 | C1.2 25.93,43.79 C18.2 C20.2 | C36.1 25.93,31.8 C37.1 | R15.1 R11.1 | Q8.2 58.55,38 56.97,38 Q6.2 | Q7.2 77.5,37.03 77.5,35.13 Q4.2 | U5.4 70.34,25.57 70.03,25.88 IC3.15
  Top 0.508: C43.- 17.14,45.01 17.14,43.18 17.78,42.55 | C34.- 18.39,43.16 17.78,42.55 | U$10.OUT- 16,39.5 16.51,40.01 16.51,41.27 17.78,42.55
  Top 0.61: IRLML2502.2 14.53,49.84 14.53,48.34 15.57,47.3 C43.- | C3.- 54.3,25.88 IC3.6 | IC3.6 IC3.7 65.28,24.61 65.43,24.77 | IC3.6 IC3.5 | IC3.5 IC3.4 IC3.17 | IC3.14 65.43,24.77 | 65.43,24.77 IC3.15 | IC3.15 IC3.16 | IC3.17 IC3.16 | IC3.15 IC3.6 | IC3.5 IC3.16 | IC2.7 IC2.14 IC2.15 | IC2.6 IC2.15 | IC2.5 IC2.16 | IC2.7 IC2.6 | IC2.6 IC2.5 | IC2.5 IC2.4 IC2.17 IC2.16 | IC2.16 IC2.15 | C6.- 70.48,32.38 69.21,31.12 68.58,31.12 67.31,29.84 67.31,29.21 66.52,28.42 IC3.17 | C12.- 71.12,23.02 71.12,23.44 72.29,24.61 IC2.7
  Top 0.813: C9.2 70.67,32.41 C6.-
  Top 1.016: R35.1 7.03,26.1 SUPPLY_IN.1
  Top 1.778: C16.2 11.79,22.07 U$10.IN- 13.72,22.86 C27.-
  Bottom 1.016: C7.2 6.49,34.39 RGB_LED.P1
  Bottom 1.524: 13.87,29.41 C5.2 13.89,31.9 C7.2 13.89,39.32 U$10.OUT- | 13.87,29.41 C4.2 | 13.87,29.41 C8.2 13.87,24.15 U$10.IN-
  Bottom 1.778: SUPPLY_IN1.1 8.87,19.16 13.87,24.15
M_DIR_1  (via drill 0.35)  (2 unrouted)
  Top 0.305: U$4.15 49.09,28.88 v49.17,28.88 | U$4.17 49.36,30.02 49.65,30.02 50.85,28.82 v50.85,27.53
  Top 0.508: R9.1 72.89,43.97 R1.1
  Top 0.61: 72.86,40.01 R9.1
M_DIR_2
  Top 0.508: R13.1 R5.1
N$1  (1 unrouted)
  Top 0.406: Q7.3 78.69,39.08 R4.1
  Top 0.61: IC2.9 IC2.12 84.15,22.07 84.73,22.66 84.73,29.08 86.61,30.96 86.61,33.27 83.97,35.92 83.97,38.1
N$2  (1 unrouted)
N$3  (1 unrouted)
N$4  (via drill 0.35)
  Top 0.813: IC2.18 v80.72,29.69
  Bottom 0.813: v80.72,29.69 80.72,43.89 83.47,46.65 MR2.P2
N$5  (1 unrouted)
  Top 0.406: Q2.3 81.11,43 R10.2
  Top 0.61: IC2.2 IC2.19 83.84,30.96 84.86,30.96 85.47,31.57 85.47,32.89 82.8,35.56 82.8,38.1
N$6  (1 unrouted)
  Top 0.406: R8.1 60.64,36.94 Q8.3
  Top 0.61: IC3.9 IC3.12
N$7  (1 unrouted)
  Top 0.406: R14.2 64.07,35.5 64.41,35.84 Q5.3
  Top 0.61: IC3.2 IC3.19
N$8  (via drill 0.35)
  Top 0.406: 80.76,35.03 R7.1 78.66,35.04 Q4.3
  Top 0.61: IC2.1 v78.1,32.23 79.86,32.23 81.23,33.6 R7.1 | IC2.11 v78.1,20.8
  Bottom 0.61: v78.1,32.23 v78.1,20.8
N$9  (via drill 0.35)  (1 unrouted)
  Top 0.406: Q6.3 56.79,34.51 R12.1
  Top 0.61: IC3.1 58.47,32.23 v58.5,32.26 | IC3.11 v63.22,20.8
  Bottom 0.61: v58.5,32.26 63.22,27.53 v63.22,20.8
N$10
  Top 0.61: R1.2 76.43,43.99 Q2.1
N$11
  Top 0.61: R2.2 76.44,35.97 Q4.1
N$12
  Top 0.61: Q7.1 74.7,39.99 R9.2
N$13
  Top 0.406: R5.2 65.36,41.02 Q5.1
N$14
  Top 0.406: R6.2 57.74,40.97 Q6.1
N$15
  Top 0.406: Q8.1 61.61,41.02 R13.2
N$16  (via drill 0.35)
  Top 0.813: IC2.13 v80.82,23.34
  Bottom 0.813: v80.82,23.34 79.5,24.66 79.5,44.58 81.47,46.55 MR2.P1
N$17  (via drill 0.35)
  Top 1.016: v75.16,23.34 IC2.8
  Bottom 0.813: MR1.P2 75.85,31.46 76.78,30.53 76.78,24.97 v75.16,23.34
N$18  (via drill 0.35)
  Top 1.016: v75.18,29.72 73.3,29.72 IC2.3
  Bottom 0.813: v75.18,29.72 73.85,31.05 MR1.P1
N$19
  Top 0.61: Q9.1 89.41,26.75 86.92,26.75 R18.2
N$20
  Top 0.61: Q9.2 91.32,25.75 R16.1
N$21
  Top 0.61: FRONTLIGHT.P1 91.21,22.03 R16.2
N$22  (1 unrouted)
N$23
  Bottom 0.61: R19.2 13.67,42.36 Q3.1
N$24  (1 unrouted)
N$25  (1 unrouted)
N$26  (1 unrouted)
N$28
  Bottom 0.61: Q3.2 11.78,41.79 R27.1
N$30
  Bottom 0.61: R26.1 9.66,43.68 8.57,44.77 Q11.2
N$31
  Bottom 0.61: RGB_LED.P4 7.33,41.76 R26.2
N$32
  Bottom 0.61: Q11.1 11.85,47.27 R21.2
N$33
  Bottom 0.61: R27.2 5.18,39.7 RGB_LED.P3
N$34
  Top 0.305: U1.20 39.26,40.75 39.65,40.36 39.65,38.76 C17.1
N$35
  Bottom 0.61: R28.2 7.14,37.76 RGB_LED.P2
N$36
  Top 0.305: C21.1 31.5,41.25 U1.10
N$37
  Top 0.813: IRLML2502.3 17.28,50.66 R22.2
N$38  (2 unrouted)
N$39  (1 unrouted)
  Top 1.016: LIDAR.P2 91.09,44.02 D1.A
N$41  (5 unrouted)
N$42  (2 unrouted)
N$43  (2 unrouted)
N$44
  Bottom 0.406: SJ3.2 24.77,46.02 PI_HEADER.37
N$45
  Bottom 0.406: SJ4.2 28.7,45.72 27.61,45.72 PI_HEADER.35
N$46  (1 unrouted)
  Top 0.305: U$4.6 36.78,26.04 32.11,26.04
  Top 0.813: Q12.1 31.7,27.9 30.29,26.54 27.23,26.56 C36.2
N$47  (1 unrouted)
  Top 0.305: 40.78,30.74 U$4.5
  Top 0.813: C37.2 27.31,34.72 Q12.3
N$49  (via drill 0.35)  (1 unrouted)
  Top 0.305: U$4.2 40.31,32.39 v40.31,31.62
N$55
  Top 1.016: IRLML2502.1 10.52,49.84 D3.A
  Top 1.27: FAN.P2 9.88,49.57 D3.A
NRST  (via drill 0.35)  (1 unrouted)
  Top 0.305: U$4.7 41.4,29.95 v41.4,28.96
PWM_M_EN_1  (via drill 0.35)  (1 unrouted)
  Top 0.305: U$4.16 49.11,29.56 49.46,29.56 50.01,29.01 v50.01,28.25
PWM_M_EN_2  (via drill 0.35)  (1 unrouted)
  Top 0.305: U$4.18 49.61,30.48 49.84,30.48 51.1,29.21 v52.71,29.21
SCL  (via drill 0.35)  (1 unrouted)
  Top 0.305: U1.23 39.61,42.25 v40.23,41.63 | v42.16,41.61 42.16,38.63 U$4.42
  Bottom 0.305: v40.23,41.63 42.14,41.63 v42.16,41.61
SDA  (1 unrouted)
  Top 0.305: U$4.43 41.28,38.81 41.28,41.91 40.43,42.75 U1.24
SWDIO  (1 unrouted)
TEMPERATURE  (via drill 0.35)  (1 unrouted)
  Top 0.406: U5.1 v68.39,22.84 v68.4,22.84
USART2_RX  (1 unrouted)
USART2_TX  (via drill 0.35)  (1 unrouted)
  Top 0.305: U$4.12 43.94,28.95 v43.94,28.19
V+
  Top 0.406: R17.2 19.35,23.16 21.73,25.54 U2.1
  Top 1.016: R34.2 7.3,31.23 SUPPLY_IN.2
  Top 1.778: SUPPLY_IN.2 3.81,27.73 3.81,25.2 SUPPLY_IN1.2 10.62,18.39 C16.1 15.34,18.39 C27.+ 18.06,18.32 R17.2
(copper drawn outside any net)
  shapes: Top area x7

### Text on the board
Top: TODO: LED für licht fehlt, für lidar lieber das gleiceh wie beim fan nahmen